# EAGLE design TMotor_Rev0_1 (EAGLE 9.6.2)

## Sheet 1 of 5: Arduino Nano Sense and Teensy
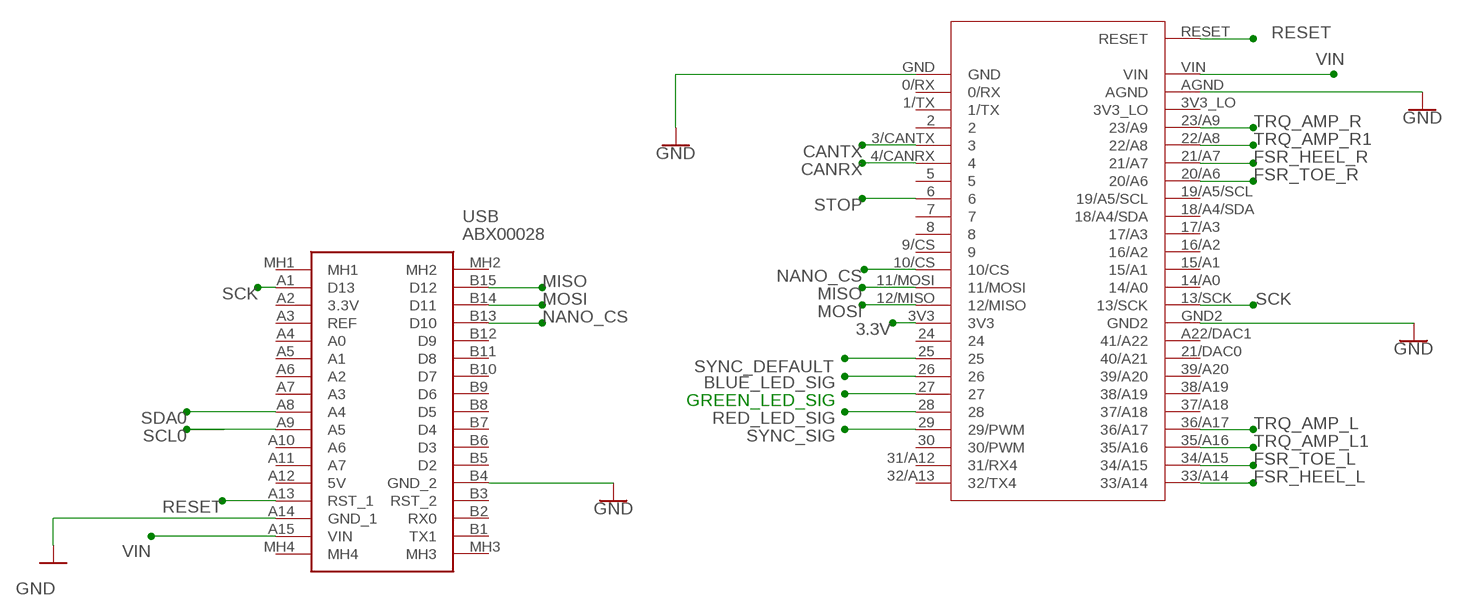
[diagram p0: schematic, sheet 1]

### Parts
U$1  TEENSY_3.5/3.6_EXTERNAL_W/RESET  [TEENSY_3.5/3.6_EXTERNAL_W/RESET]
USB  ABX00028  [ABX00028]

### Nets
3.3V: U$1.3V3 ; also sheet 2,3,5
BLUE_LED_SIG: U$1.26 ; also sheet 4
CANRX: U$1.4/CANRX ; also sheet 2
CANTX: U$1.3/CANTX ; also sheet 2
FSR_HEEL_L: U$1.33/A14 ; also sheet 3
FSR_HEEL_R: U$1.21/A7 ; also sheet 3
FSR_TOE_L: U$1.34/A15 ; also sheet 3
FSR_TOE_R: U$1.20/A6 ; also sheet 3
GND: U$1.AGND U$1.GND U$1.GND2 USB.A14(GND_1) USB.B4(GND_2) ; also sheet 2,3,4,5
GREEN_LED_SIG: U$1.27 ; also sheet 4
MISO: U$1.11/MOSI USB.B15(D12)
MOSI: U$1.12/MISO USB.B14(D11)
NANO_CS: U$1.10/CS USB.B13(D10)
RED_LED_SIG: U$1.28 ; also sheet 4
RESET: U$1.RESET USB.A13(RST_1) ; also sheet 2
SCK: U$1.13/SCK USB.A1(D13)
SCL0: USB.A9(A5) ; also sheet 2
SDA0: USB.A8(A4) ; also sheet 2
STOP: U$1.6 ; also sheet 2
SYNC_DEFAULT: U$1.25 ; also sheet 2
SYNC_SIG: U$1.29(29/PWM) ; also sheet 4
TRQ_AMP_L: U$1.36/A17 ; also sheet 5
TRQ_AMP_L1: U$1.35/A16 ; also sheet 5
TRQ_AMP_R: U$1.23/A9 ; also sheet 5
TRQ_AMP_R1: U$1.22/A8 ; also sheet 5
VIN: U$1.VIN USB.A15(VIN) ; also sheet 2,4
Unconnected: U$1.0/RX U$1.1/TX U$1.2 U$1.3V3_LO U$1.5 U$1.7 U$1.8 U$1.9/CS U$1.14/A0 U$1.15/A1 U$1.16/A2 U$1.17/A3 U$1.18/A4/SDA U$1.19/A5/SCL U$1.21/DAC0(40/A21) U$1.24 U$1.30(30/PWM) U$1.31/A12(31/RX4) U$1.32/A13(32/TX4) U$1.37/A18 U$1.38/A19 U$1.39/A20 U$1.A22/DAC1(41/A22) USB.A2(3.3V) USB.A3(REF) USB.A4(A0) USB.A5(A1) USB.A6(A2) USB.A7(A3) USB.A10(A6) USB.A11(A7) USB.A12(5V) USB.B1(TX1) USB.B2(RX0) USB.B3(RST_2) USB.B5(D2) USB.B6(D3) USB.B7(D4) USB.B8(D5) USB.B9(D6) USB.B10(D7) USB.B11(D8) USB.B12(D9) USB.MH1 USB.MH2 USB.MH3 USB.MH4

## Sheet 2 of 5: Motor Drivers & Power
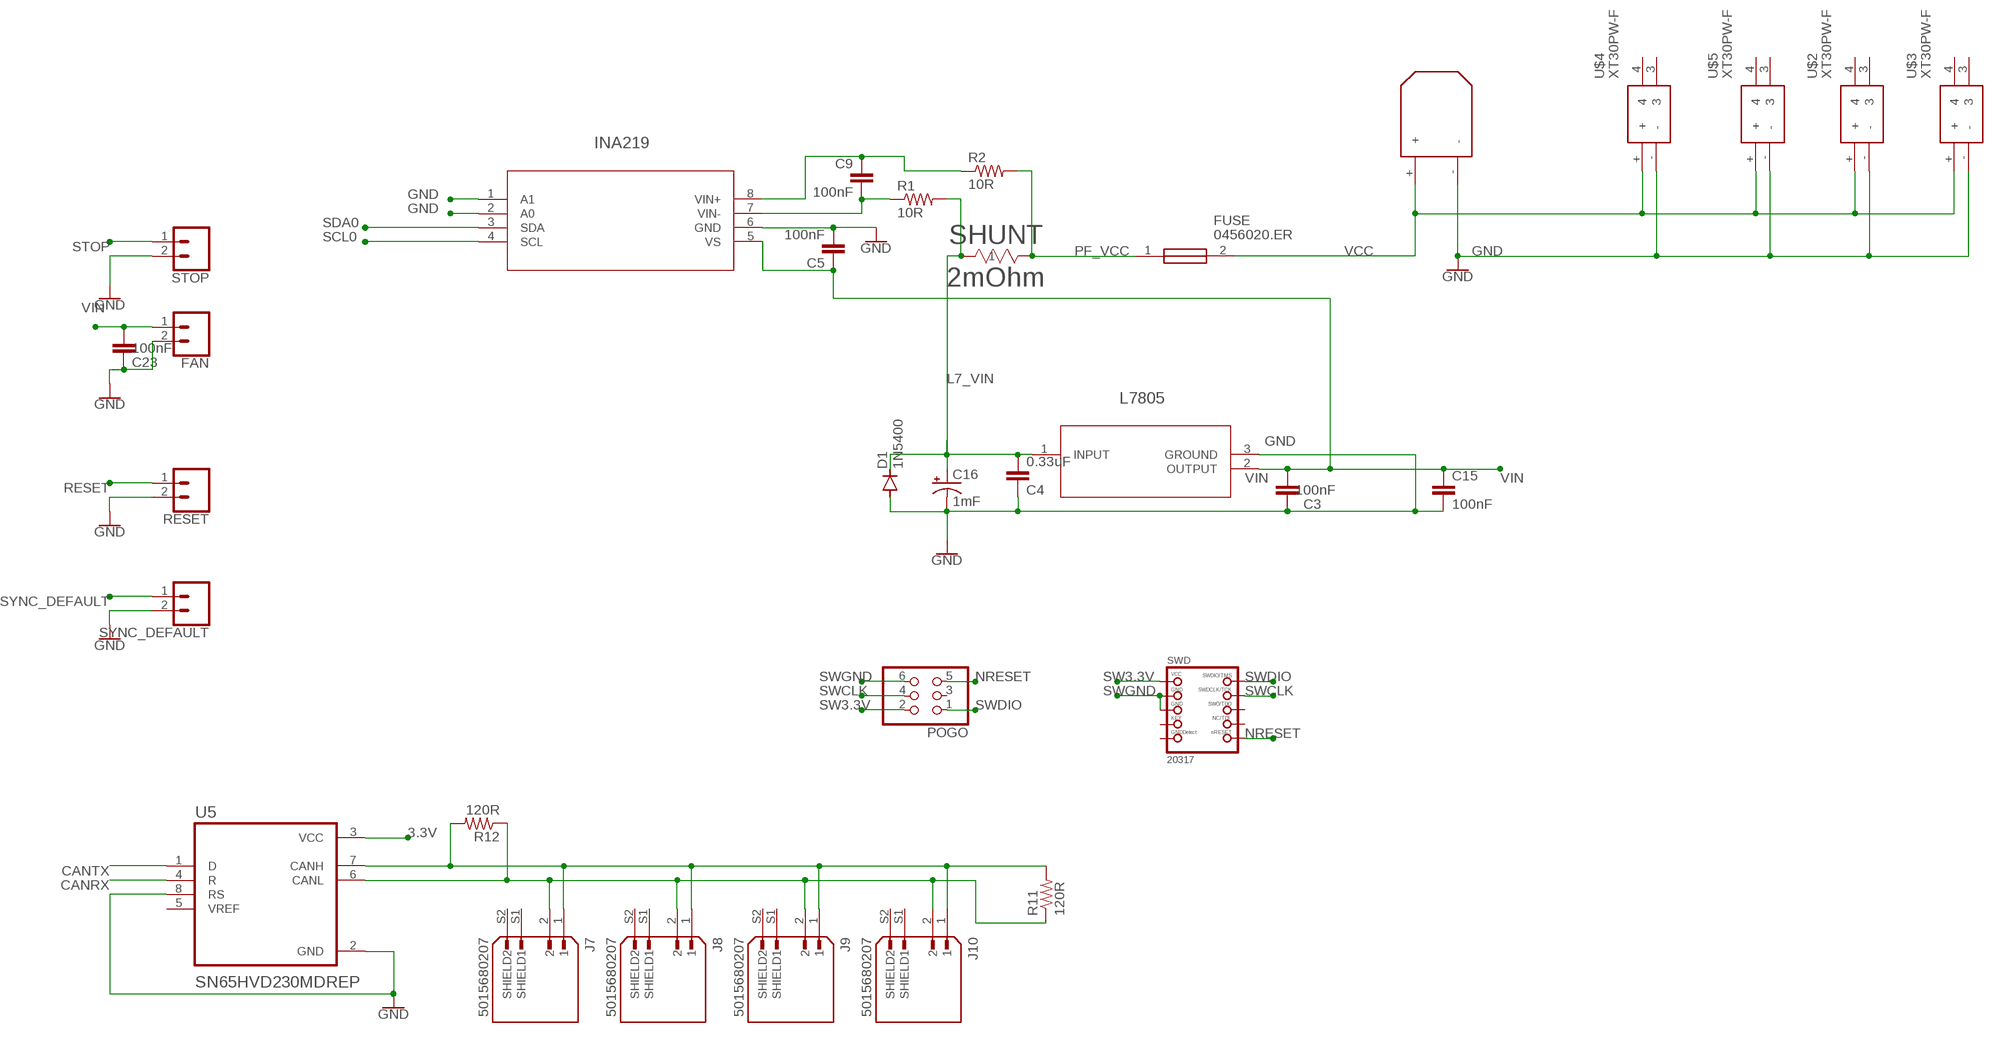
[diagram p1: schematic, sheet 2]

### Parts
C3  100nF  C-EU050-024X044  [C050-024X044]
C4  0.33uF  C-EU050-024X044  [C050-024X044]
C5  100nF  C-EU050-024X044  [C050-024X044]
C9  100nF  C-EU050-024X044  [C050-024X044]
C15  100nF  C-EU050-024X044  [C050-024X044]
C16  1mF  CPOL-USE5-10.5  [E5-10,5]
C23  100nF  C-EU050-024X044  [C050-024X044]
D1  1N5400  [DO201-15]
FAN  CONN_02  [1X02]
FUSE  0456020.ER  [FUSC10131X312N]
INA219  INA219AIDR  [D8_TEX]
J7  5015680207  [MOLEX_5015680207]
J8  5015680207  [MOLEX_5015680207]
J9  5015680207  [MOLEX_5015680207]
J10  5015680207  [MOLEX_5015680207]
L7805  L7805CDT-TR  [DPAK_STM]
POGO  PINHD-2X3  [2X03]
R1  10R  R-US_0207/10  [0207/10]
R2  10R  R-US_0207/10  [0207/10]
R11  120R  R-US_0207/10  [0207/10]
R12  120R  R-US_0207/10  [0207/10]
RESET  CONN_02  [1X02]
SHUNT  2mOhm  CSNL2512FT2L00  [STA_CSNL2512(2)_STP]
STOP  CONN_02  [1X02]
SWD  20317  JTAG-CORTEXBOXPOSTS  [2X05_1.27MM_BOX_POSTS]
SYNC_DEFAULT  CONN_02  [1X02]
U5  SN65HVD230MDREP  [SOIC127P599X175-8N]
U$2  XT30PW-F  [XT30PWF]
U$3  XT30PW-F  [XT30PWF]
U$4  XT30PW-F  [XT30PWF]
U$5  XT30PW-F  [XT30PWF]
U$9  XT30  [XT30_HORIZONTAL]

### Nets
3.3V: U5.3(VCC) ; also sheet 1,3,5
CANRX: U5.4(R) ; also sheet 1
CANTX: U5.1(D) ; also sheet 1
GND: C3.1 C4.1 C5.2 C15.2 C16.- C23.1 D1.A FAN.2 INA219.1(A1) INA219.2(A0) INA219.6(GND) L7805.3(GROUND) RESET.2 STOP.2 SYNC_DEFAULT.2 U5.2(GND) U5.8(RS) U$2.- U$3.- U$4.- U$5.- U$9.- ; also sheet 1,3,4,5
L7_VIN: C4.2 C16.+ D1.C L7805.1(INPUT) R1.2 SHUNT.1
N$23: C9.1 INA219.8(VIN+) R2.1
N$26: C9.2 INA219.7(VIN-) R1.1
N$44: J7.1 J8.1 J9.1 J10.1 R11.2 R12.2 U5.7(CANH)
N$45: J7.2 J8.2 J9.2 J10.2 R11.1 R12.1 U5.6(CANL)
NRESET: POGO.5 SWD.10(NRESET)
PF_VCC: FUSE.1 R2.2 SHUNT.2
RESET: RESET.1 ; also sheet 1
SCL0: INA219.4(SCL) ; also sheet 1
SDA0: INA219.3(SDA) ; also sheet 1
STOP: STOP.1 ; also sheet 1
SW3.3V: POGO.2 SWD.1(VCC)
SWCLK: POGO.4 SWD.4(SWDCLK)
SWDIO: POGO.1 SWD.2(SWDIO)
SWGND: POGO.6 SWD.3(GND) SWD.5(GND)
SYNC_DEFAULT: SYNC_DEFAULT.1 ; also sheet 1
VCC: FUSE.2 U$2.+ U$3.+ U$4.+ U$5.+ U$9.+
VIN: C3.2 C5.1 C15.1 C23.2 FAN.1 INA219.5(VS) L7805.2(OUTPUT) ; also sheet 1,4
Unconnected: J7.S1(SHIELD1) J7.S2(SHIELD2) J8.S1(SHIELD1) J8.S2(SHIELD2) J9.S1(SHIELD1) J9.S2(SHIELD2) J10.S1(SHIELD1) J10.S2(SHIELD2) POGO.3 SWD.6(SWO) SWD.7(KEY) SWD.8(TDI) SWD.9(GNDDETECT) U5.5(VREF) U$2.3 U$2.4 U$3.3 U$3.4 U$4.3 U$4.4 U$5.3 U$5.4

## Sheet 3 of 5: FSRs filters
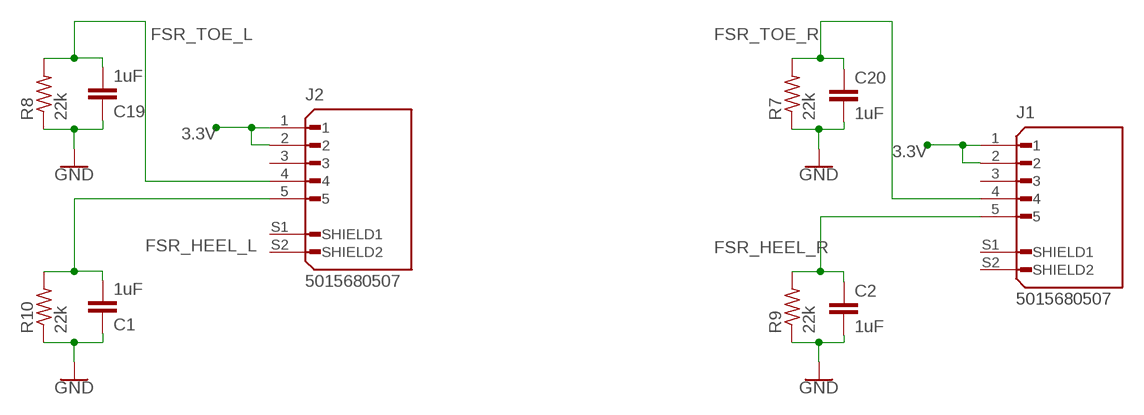
[diagram p2: schematic, sheet 3]

### Parts
C1  1uF  C-EU050-024X044  [C050-024X044]
C2  1uF  C-EU050-024X044  [C050-024X044]
C19  1uF  C-EU050-024X044  [C050-024X044]
C20  1uF  C-EU050-024X044  [C050-024X044]
J1  5015680507  [MOLEX_5015680507]
J2  5015680507  [MOLEX_5015680507]
R7  22k  R-US_0207/10  [0207/10]
R8  22k  R-US_0207/10  [0207/10]
R9  22k  R-US_0207/10  [0207/10]
R10  22k  R-US_0207/10  [0207/10]

### Nets
3.3V: J1.1 J1.2 J2.1 J2.2 ; also sheet 1,2,5
FSR_HEEL_L: C1.2 J2.5 R10.2 ; also sheet 1
FSR_HEEL_R: C2.1 J1.5 R9.2 ; also sheet 1
FSR_TOE_L: C19.2 J2.4 R8.2 ; also sheet 1
FSR_TOE_R: C20.1 J1.4 R7.2 ; also sheet 1
GND: C1.1 C2.2 C19.1 C20.2 R7.1 R8.1 R9.1 R10.1 ; also sheet 1,2,4,5
Unconnected: J1.3 J1.S1(SHIELD1) J1.S2(SHIELD2) J2.3 J2.S1(SHIELD1) J2.S2(SHIELD2)

## Sheet 4 of 5: LED
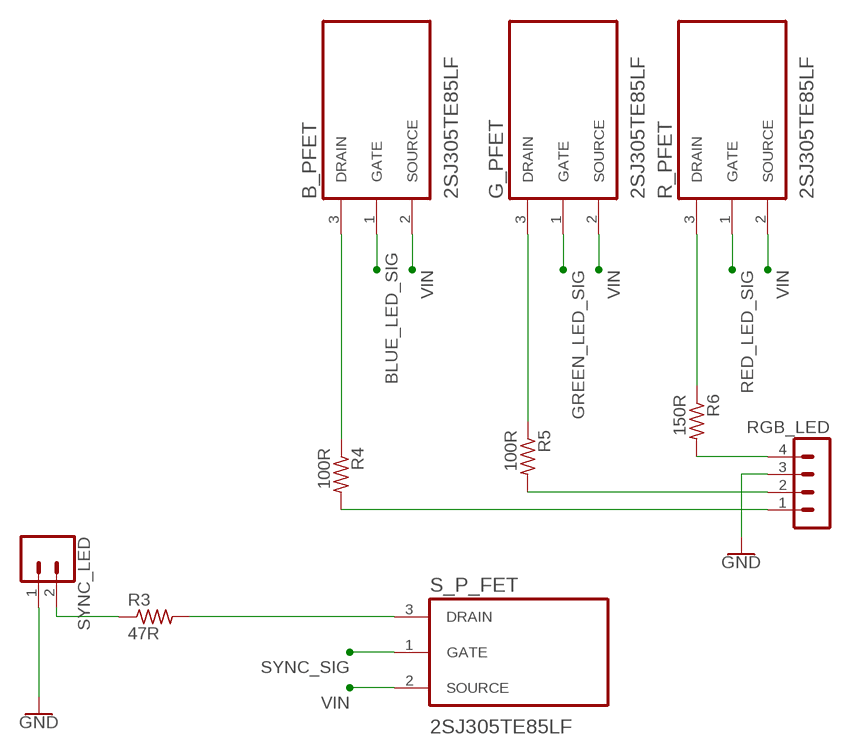
[diagram p3: schematic, sheet 4]

### Parts
B_PFET  2SJ305TE85LF  [TRANS_SSM3J325F,LF]
G_PFET  2SJ305TE85LF  [TRANS_SSM3J325F,LF]
R3  47R  R-US_0207/10  [0207/10]
R4  100R  R-US_0207/10  [0207/10]
R5  100R  R-US_0207/10  [0207/10]
R6  150R  R-US_0207/10  [0207/10]
R_PFET  2SJ305TE85LF  [TRANS_SSM3J325F,LF]
RGB_LED  MA04-1  [MA04-1]
S_P_FET  2SJ305TE85LF  [TRANS_SSM3J325F,LF]
SYNC_LED  CONN_02  [1X02]

### Nets
BLUE_LED_SIG: B_PFET.1(GATE) ; also sheet 1
GND: RGB_LED.3 SYNC_LED.1 ; also sheet 1,2,3,5
GREEN_LED_SIG: G_PFET.1(GATE) ; also sheet 1
N$1: R4.2 RGB_LED.1
N$2: B_PFET.3(DRAIN) R4.1
N$17: R3.2 S_P_FET.3(DRAIN)
N$18: R3.1 SYNC_LED.2
N$24: R6.2 RGB_LED.4
N$25: R5.2 RGB_LED.2
N$30: G_PFET.3(DRAIN) R5.1
N$31: R6.1 R_PFET.3(DRAIN)
RED_LED_SIG: R_PFET.1(GATE) ; also sheet 1
SYNC_SIG: S_P_FET.1(GATE) ; also sheet 1
VIN: B_PFET.2(SOURCE) G_PFET.2(SOURCE) R_PFET.2(SOURCE) S_P_FET.2(SOURCE) ; also sheet 1,2

## Sheet 5 of 5: Bluetooth
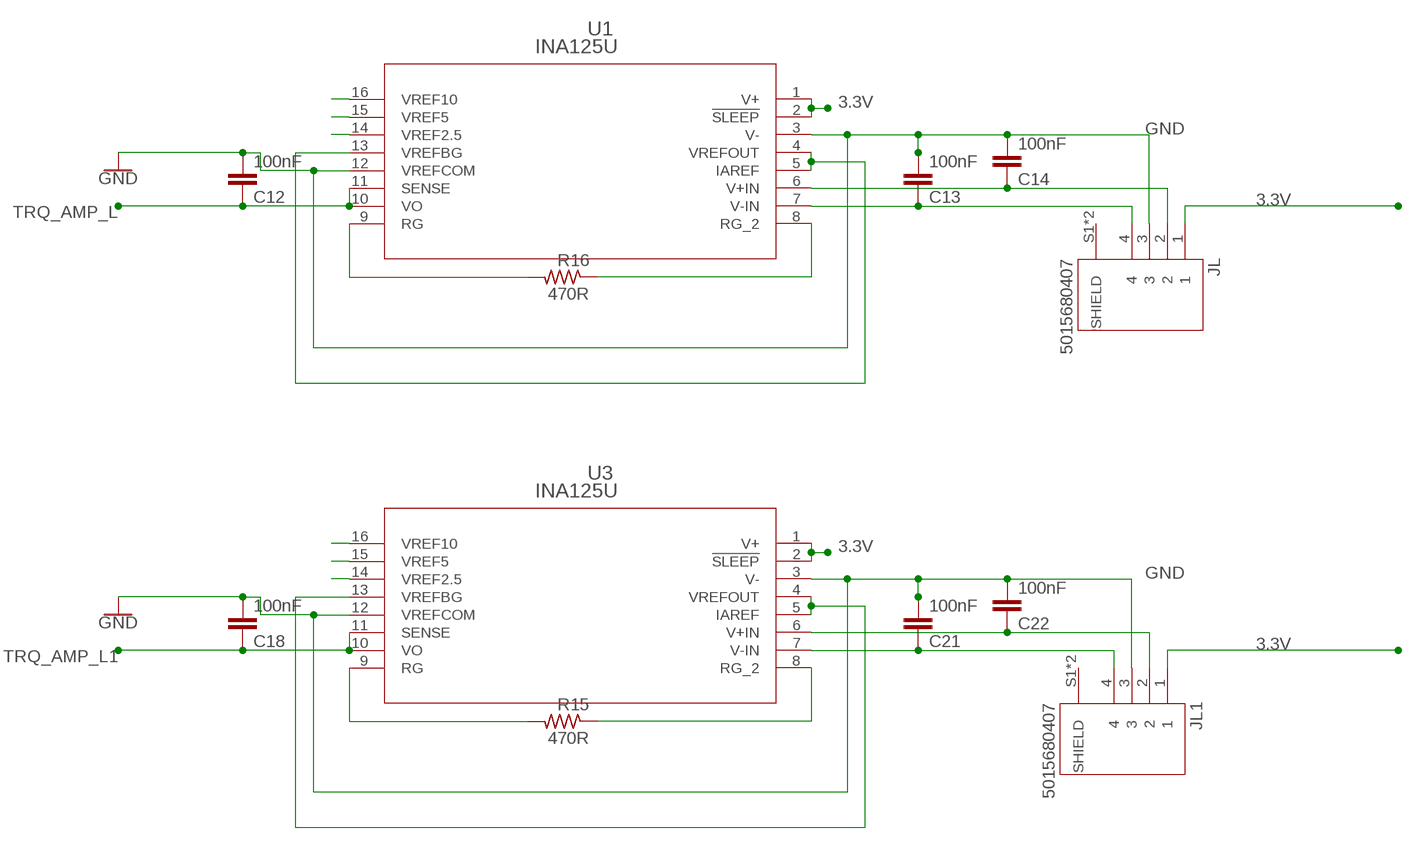
[diagram p4: schematic, sheet 5, part 1 of 2]
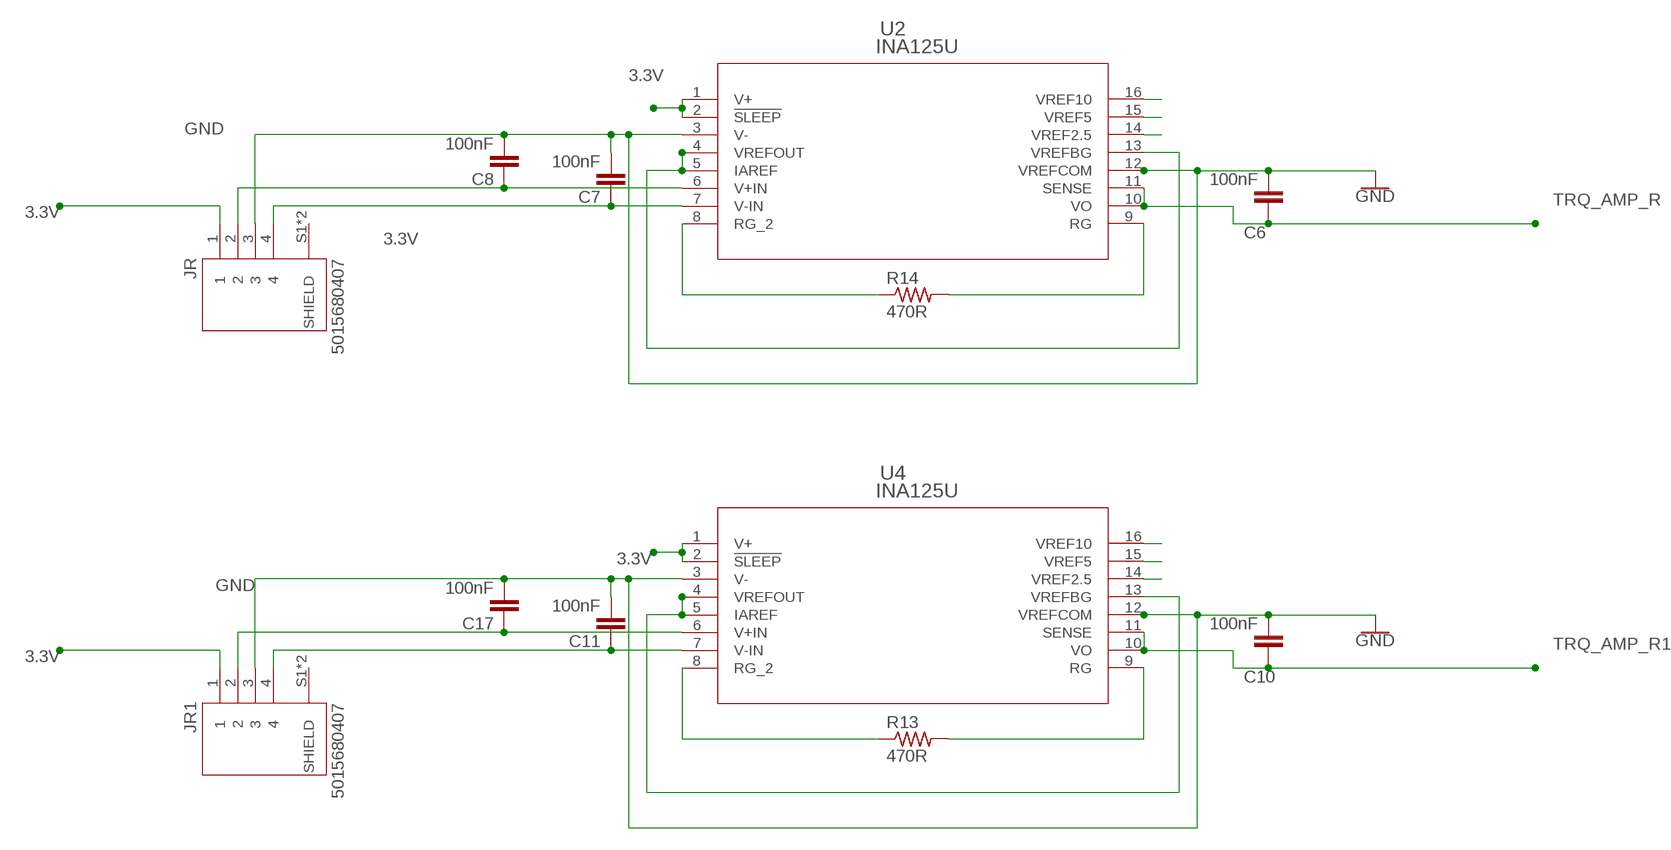
[diagram p5: schematic, sheet 5, part 2 of 2]

### Parts
C6  100nF  C-EU050-024X044  [C050-024X044]
C7  100nF  C-EU050-024X044  [C050-024X044]
C8  100nF  C-EU050-024X044  [C050-024X044]
C10  100nF  C-EU050-024X044  [C050-024X044]
C11  100nF  C-EU050-024X044  [C050-024X044]
C12  100nF  C-EU050-024X044  [C050-024X044]
C13  100nF  C-EU050-024X044  [C050-024X044]
C14  100nF  C-EU050-024X044  [C050-024X044]
C17  100nF  C-EU050-024X044  [C050-024X044]
C18  100nF  C-EU050-024X044  [C050-024X044]
C21  100nF  C-EU050-024X044  [C050-024X044]
C22  100nF  C-EU050-024X044  [C050-024X044]
JL  5015680407  [MOLEX_5015680407]
JL1  5015680407  [MOLEX_5015680407]
JR  5015680407  [MOLEX_5015680407]
JR1  5015680407  [MOLEX_5015680407]
R13  470R  R-US_0207/10  [0207/10]
R14  470R  R-US_0207/10  [0207/10]
R15  470R  R-US_0207/10  [0207/10]
R16  470R  R-US_0207/10  [0207/10]
U1  INA125U  [D16]
U2  INA125U  [D16]
U3  INA125U  [D16]
U4  INA125U  [D16]

### Nets
3.3V: JL1.1 JL.1 JR1.1 JR.1 U1.1(V+) U1.2(!SLEEP) U2.1(V+) U2.2(!SLEEP) U3.1(V+) U3.2(!SLEEP) U4.1(V+) U4.2(!SLEEP) ; also sheet 1,2,3
GND: C6.2 C7.2 C8.2 C10.2 C11.2 C12.2 C13.2 C14.2 C17.2 C18.2 C21.2 C22.2 JL1.3 JL.3 JR1.3 JR.3 U1.3(V-) U1.12(VREFCOM) U2.3(V-) U2.12(VREFCOM) U3.3(V-) U3.12(VREFCOM) U4.3(V-) U4.12(VREFCOM) ; also sheet 1,2,3,4
N$3: U1.4(VREFOUT) U1.5(IAREF) U1.13(VREFBG)
N$4: U4.16(VREF10)
N$5: U2.4(VREFOUT) U2.5(IAREF) U2.13(VREFBG)
N$6: R14.1 U2.8(RG_2)
N$7: R14.2 U2.9(RG)
N$8: C8.1 JR.2 U2.6(V+IN)
N$9: C7.1 JR.4 U2.7(V-IN)
N$10: C14.1 JL.2 U1.6(V+IN)
N$11: C13.1 JL.4 U1.7(V-IN)
N$12: R16.2 U1.9(RG)
N$13: R16.1 U1.8(RG_2)
N$14: U4.15(VREF5)
N$15: U4.4(VREFOUT) U4.5(IAREF) U4.13(VREFBG)
N$16: R13.1 U4.8(RG_2)
N$19: U4.14(VREF2.5)
N$20: U2.16(VREF10)
N$21: U2.15(VREF5)
N$22: U2.14(VREF2.5)
N$27: R13.2 U4.9(RG)
N$28: C17.1 JR1.2 U4.6(V+IN)
N$29: C11.1 JR1.4 U4.7(V-IN)
N$32: U3.4(VREFOUT) U3.5(IAREF) U3.13(VREFBG)
N$33: C22.1 JL1.2 U3.6(V+IN)
N$34: C21.1 JL1.4 U3.7(V-IN)
N$35: R15.2 U3.9(RG)
N$36: R15.1 U3.8(RG_2)
N$37: U1.16(VREF10)
N$38: U1.15(VREF5)
N$39: U1.14(VREF2.5)
N$40: U3.16(VREF10)
N$41: U3.15(VREF5)
N$42: U3.14(VREF2.5)
TRQ_AMP_L: C12.1 U1.10(VO) U1.11(SENSE) ; also sheet 1
TRQ_AMP_L1: C18.1 U3.10(VO) U3.11(SENSE) ; also sheet 1
TRQ_AMP_R: C6.1 U2.10(VO) U2.11(SENSE) ; also sheet 1
TRQ_AMP_R1: C10.1 U4.10(VO) U4.11(SENSE) ; also sheet 1
Unconnected: JL1.S1(SHIELD) JL1.S2(SHIELD) JL.S1(SHIELD) JL.S2(SHIELD) JR1.S1(SHIELD) JR1.S2(SHIELD) JR.S1(SHIELD) JR.S2(SHIELD)

## Library data of the parts
B_PFET G_PFET R_PFET S_P_FET = 2SJ305TE85LF:2SJ305TE85LF: None Check prices <https://pricing.snapeda.com/parts/2SJ305TE85LF/Toshiba/view-part?ref=eda>; AVAILABILITY: In Stock; DESCRIPTION: P-Channel 30V 200mA (Ta) 200mW (Ta) Surface Mount SC-59; MF: Toshiba; MP: 2SJ305TE85LF; PACKAGE: SC-59 Toshiba; PRICE: None; PURCHASE-URL: https://pricing.snapeda.com/search/part/2SJ305TE85LF/?ref=eda
C1-C15 C17-C23 = rcl:C-EU: CAPACITOR, European symbol; SPICEPREFIX: C
C16 = rcl:CPOL-US: POLARIZED CAPACITOR, American symbol; SPICEPREFIX: C
D1 = diode:1N5400: DIODE standard rectifier, 3 A, 50 V (Motorola)
FAN RESET STOP SYNC_DEFAULT SYNC_LED = SparkFun-Connectors:CONN_02: Multi connection point. Often used as Generic Header-pin footprint for 0.1 inch spaced/style header connections On any of the 0.1 inch spaced packages, you can populate with these: Break Away Headers - Straight <https://www.sparkfun.com/products/116> (PRT-00116) Break Away Male Headers - Right Angle <https://www.sparkfun.com/products/553> (PRT-00553) Female Headers <https://www.sparkfun.com/products/115> (PRT-00115) Break Away Headers - Machine Pin <https://www.sparkfun.com/products/117> (PRT-00117) Break Away Female Headers - Swiss Machine Pin <https://www.sparkfun.com/products/743> (PRT-00743) For SCREWTERMINALS and SPRING TERMINALS visit here: Screw Terimnals on SparkFun.com <https://www.sparkfun.com/search/results?term=Screw+Terminals> (5mm/3.5mm/2.54mm spacing) This device is also useful as a general connection point to wire up your design to another part of your project. Our various solder wires solder well into these plated through hole pads. Hook-Up Wire - Assortment (Stranded, 22 AWG) <https://www.sparkfun.com/products/11375> (PRT-11375) Hook-Up Wire - Assortment (Solid Core, 22 AWG) <https://www.sparkfun.com/products/11367> (PRT-11367) View the entire wire category on our website here <https://www.sparkfun.com/categories/141> Special notes: Molex polarized connector foot print use with: PRT-08233 with associated crimp pins and housings. 2.54_SCREWTERM for use with PRT-10571. 3.5mm Screw Terminal footprints for PRT-08084 5mm Screw Terminal footprints for use with PRT-08432
FUSE = SamacSys_Parts:0456020.ER: Littelfuse 20A FF Non-Resettable Surface Mount Fuse, 125V ac Source: Datasheet <https://componentsearchengine.com/Datasheets/1/0456020.ER.pdf>; DESCRIPTION: Littelfuse 20A FF Non-Resettable Surface Mount Fuse, 125V ac; HEIGHT: 3.12mm; MANUFACTURER_NAME: LITTELFUSE; MANUFACTURER_PART_NUMBER: 0456020.ER; MOUSER_PART_NUMBER: 576-0456020.ER; MOUSER_PRICE-STOCK: https://www.mouser.com/Search/Refine.aspx?Keyword=576-0456020.ER
INA219 = INA219:INA219AIDR; BUILT_BY: EMA_UL_Team; MANUFACTURER_PART_NUMBER: INA219AIDR; SOURCELIBRARY: TI_2015-1-5; VENDOR: Texas Instruments
J1 J2 = SnapEDA-Library:5015680507; MANUFACTURER: Molex; MAXIMUM_PACKAGE_HEIGHT: 3.2 mm; PARTREV: A; STANDARD: Manufacturer Recommendations
J7-J10 = SnapEDA-Library:5015680207; MANUFACTURER: Molex; MAXIMUM_PACKAGE_HEIGHT: 3.2 mm; PARTREV: A; STANDARD: Manufacturer Recommendations
JL JL1 JR JR1 = SnapEDA-Library:5015680407: Conn Shrouded Header HDR 4 POS 1mm Solder RA SMD Pico-Clasp????? Embossed T/R; MANUFACTURER: MOLEX; PARTREV: C; STANDARD: Manufacturer Recommendation
L7805 = 7805Regulator:L7805CDT-TR; BUILT_BY: EMA_UL_Team; MANUFACTURER_PART_NUMBER: L7805CDT-TR; SOURCELIBRARY: StMicro_2011-06-07; VENDOR: STMicroelectronics
POGO = pinhead:PINHD-2X3: PIN HEADER
R1-R6 R11-R16 = rcl:R-US_: RESISTOR, American symbol; SPICEPREFIX: R
R7-R10 = resistor:R-US_: RESISTOR, American symbol
RGB_LED = con-lstb:MA04-1: PIN HEADER; OC_FARNELL: unknown; OC_NEWARK: unknown
SHUNT = ShuntResistor:CSNL2512FT2L00; BUILT_BY: EMA_UL_Team; MANUFACTURER_PART_NUMBER: CSNL2512FT2L00; SOURCELIBRARY: Stackpole_2014-12-31; VENDOR: Stackpole International
SWD = microbuilder:JTAG-CORTEX: Serial Wire (SW-DP) Connector Standard 0.05" 10-pin connector is for use with the Cortex M and Cortex A SWD (serial wire debugger) interface (SW-DP) Connectors 2x05_1.27MM_SMT - Inexpensive surface-mount header with bare pins, compatible with standard 10-pin SWD cables (4UCON: 16846) 2x05_1.27MM_BOX_NOPOSTS - Polarised surface-mount box (4UCON with caps: 19735, without caps: 15117 2x05_1.27MM_BOX_POSTS - Polarised surface-mount box with mounting holes (4UCON: 20317) Pinout: http://infocenter.arm.com/help/topic/com.arm.doc.faqs/attached/13634/cortex_debug_connectors.pdf http://www.keil.com/peripherals/coresight/connectors.asp
U1-U4 = Digikey:INA125U; DATASHEET_URL: http://www.ti.com/lit/gpn/INA125; DESCRIPTION: Instrumentation Amplifier with Precision Voltage Reference; FAMILY_NAME: SINGLE SUPPLY; GENERIC_PART_NUMBER: INA125; INDUSTRY_STD_PKG_TYPE: SOIC; MANUFACTURER: Texas Instruments; MANUFACTURER_PART_NUMBER: INA125U; PACKAGE_DESIGNATOR: D; PIN_COUNT: 16; VENDOR: Texas Instruments
U5 = SnapEDA-Library:SN65HVD230MDREP
U$1 = Teensy356:TEENSY_3.5/3.6_EXTERNAL_W/RESET
U$2-U$5 = XT30PW-M:XT30PW-F
U$9 = Ben_Library:XT30
USB = ABX00028:ABX00028: Development Boards & Kits - AVR Arduino Nano Every Source: Datasheet <https://store.arduino.cc/arduino-nano-every>; ARROW_PART_NUMBER: ABX00028; ARROW_PRICE-STOCK: https://www.arrow.com/en/products/abx00028/arduino-corporation; DESCRIPTION: Development Boards & Kits - AVR Arduino Nano Every; HEIGHT: 10mm; MANUFACTURER_NAME: Arduino; MANUFACTURER_PART_NUMBER: ABX00028; MOUSER_PART_NUMBER: 782-ABX00028; MOUSER_PRICE-STOCK: https://www.mouser.co.uk/ProductDetail/Arduino/ABX00028/?qs=PzGy0jfpSMtit6rnFl8mVg%3D%3D

## Board
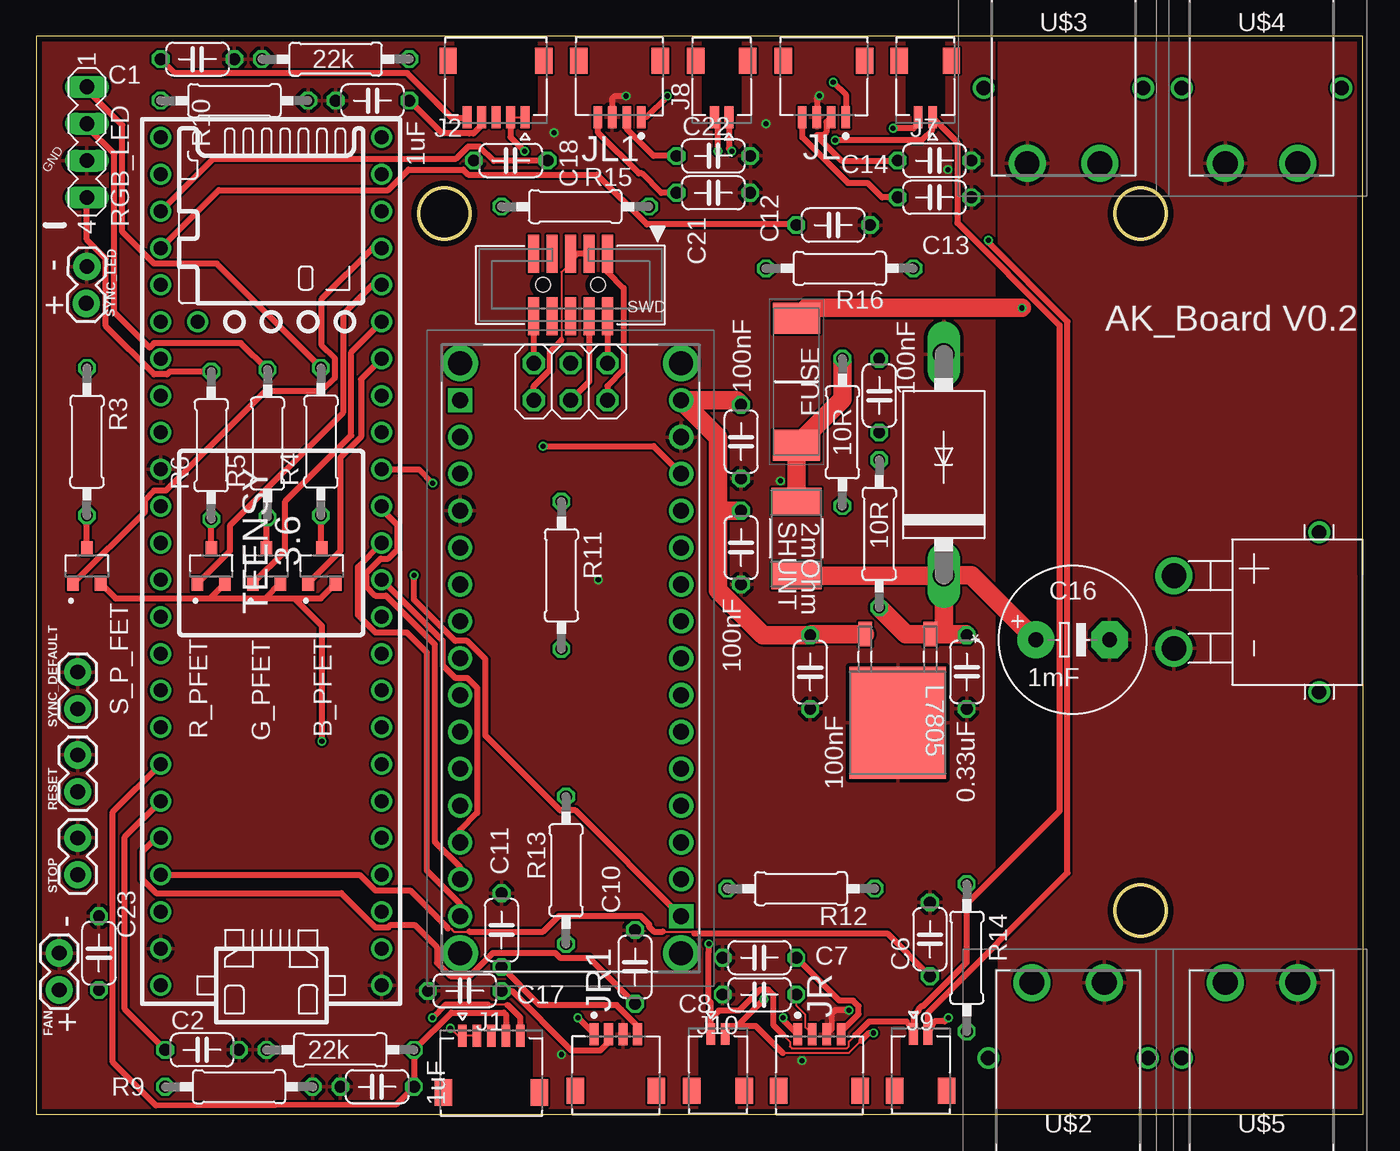
[diagram p6: board, top side]
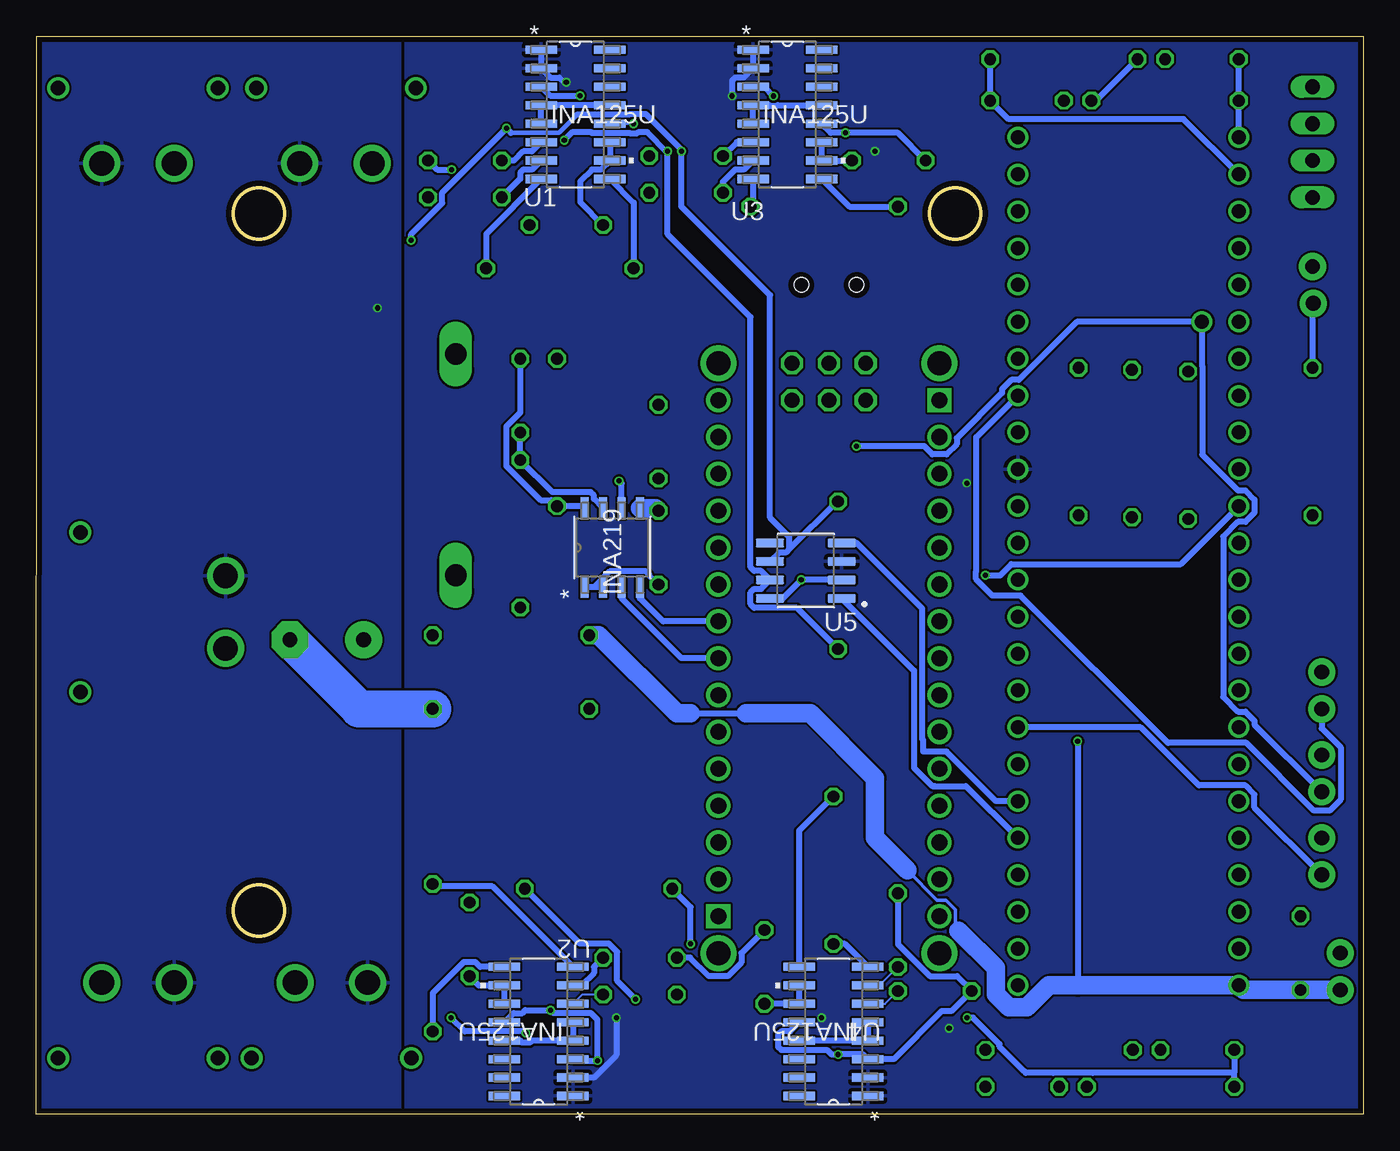
[diagram p7: board, bottom side, seen from below]

Size 91.46 x 74.28 mm. Coordinates in mm from the lower left corner, seen from the top.
Outline: 0,0 91.46,0 91.42,74.28 0,74.28 0,0
Outline: circle at 28.13,62.06 radius 1.75
Outline: circle at 76.13,62.06 radius 1.75
Outline: circle at 76.13,14.06 radius 1.75
Copper layers (1*16): Top 0.035559375mm / dielectric 1.6mm / Bottom 0.035559375mm
Design rules "oshpark-2layer": minimum track width 6mil, minimum drill 10mil, track to track 6mil, track to pad 6mil, pad to pad 6mil, via to via 6mil, smd to smd 6mil, copper to edge 15mil, drill to drill 6mil, minimum pad ring 5mil, minimum via ring 5mil, stop-mask expansion 2.5mil, vias tented up to drill 0mil, thermal gap 10mil

### Footprints (pad centres in the part's own frame; a part is rotated, then mirrored left to right if it is on the bottom)
TRANS_SSM3J325F,LF = smd 1 x 0.8: 1 -1.2,0.95; 2 -1.2,-0.95; 3 1.2,0
C050-024X044 = drill 0.813 octagon: 1 -2.54,0; 2 2.54,0
E5-10,5 = drill 1.016 pad 2.54: + -2.54,0 | drill 1.016 pad 2.54 octagon: - 2.54,0
DO201-15 = drill 1.499 long: A 7.62,0; C -7.62,0
1X02 = drill 1.016 pad 1.88: 1 0,0; 2 2.54,0
FUSC10131X312N = smd 2.16 x 3.23: 1 -4.375,0; 2 4.375,0
D8_TEX = smd 1.46 x 0.559: 1 -2.724,1.905; 2 -2.724,0.635; 3 -2.724,-0.635; 4 -2.724,-1.905; 5 2.724,-1.905; 6 2.724,-0.635; 7 2.724,0.635; 8 2.724,1.905
MOLEX_5015680507 = smd 0.6 x 1.5: 1 -2,2.55; 2 -1,2.55; 3 0,2.55; 4 1,2.55; 5 2,2.55 | smd 1.2 x 1.8: S1 3.3,-1.35; S2 -3.3,-1.35
MOLEX_5015680207 = smd 0.6 x 1.5: 1 -0.5,2.55; 2 0.5,2.55 | smd 1.2 x 1.8: S1 1.8,-1.35; S2 -1.8,-1.35
MOLEX_5015680407 = smd 0.6 x 1.5: 1 -1.5,0; 2 -0.5,0; 3 0.5,0; 4 1.5,0 | smd 1.2 x 1.8: S1 -2.8,-3.9; S2 2.8,-3.9
DPAK_STM = smd 0.94 x 1.702: 1 -2.25,-6.109; 2 2.25,-6.109 | smd 6.655 x 7.722: 3 0,0
2X03 = drill 1.016 octagon: 1 -2.54,-1.27; 2 -2.54,1.27; 3 0,-1.27; 4 0,1.27; 5 2.54,-1.27; 6 2.54,1.27
0207/10 = drill 0.813 octagon: 1 -5.08,0; 2 5.08,0
MA04-1 = drill 1.016 long: 1 -3.81,0; 2 -1.27,0; 3 1.27,0; 4 3.81,0
STA_CSNL2512(2)_STP = smd 1.88 x 3.429: 1 -2.565,0; 2 2.565,0
2X05_1.27MM_BOX_POSTS = smd 0.76 x 2.6: 1 -2.54,-2.15; 2 -2.54,2.15; 3 -1.27,-2.15; 4 -1.27,2.15; 5 0,-2.15; 6 0,2.15; 7 1.27,-2.15; 8 1.27,2.15; 9 2.54,-2.15; 10 2.54,2.15 | hole 1: -1.905,0; 1.905,0
D16 = smd 2.184 x 0.559: 1 -2.362,4.445; 2 -2.362,3.175; 3 -2.362,1.905; 4 -2.362,0.635; 5 -2.362,-0.635; 6 -2.362,-1.905; 7 -2.362,-3.175; 8 -2.362,-4.445; 9 2.362,-4.445; 10 2.362,-3.175; 11 2.362,-1.905; 12 2.362,-0.635; 13 2.362,0.635; 14 2.362,1.905; 15 2.362,3.175; 16 2.362,4.445
SOIC127P599X175-8N = smd 1.97 x 0.6: 1 -2.47,1.905; 2 -2.47,0.635; 3 -2.47,-0.635; 4 -2.47,-1.905; 5 2.47,-1.905; 6 2.47,-0.635; 7 2.47,0.635; 8 2.47,1.905
TEENSY_3.5/3.6_EXTERNAL_W/RESET = drill 0.965: 0/RX -25.4,-7.62; 1/TX -22.86,-7.62; 2 -20.32,-7.62; 3/CANTX -17.78,-7.62; 3V3 7.62,-7.62; 3V3_LO -22.86,7.62; 4/CANRX -15.24,-7.62; 5 -12.7,-7.62; 6 -10.16,-7.62; 7 -7.62,-7.62; 8 -5.08,-7.62; 9/CS -2.54,-7.62; 10/CS 0,-7.62; 11/MOSI 2.54,-7.62; 12/MISO 5.08,-7.62; 13/SCK 5.08,7.62; 14/A0 2.54,7.62; 15/A1 0,7.62; 16/A2 -2.54,7.62; 17/A3 -5.08,7.62; 18/A4/SDA -7.62,7.62; 19/A5/SCL -10.16,7.62; 20/A6 -12.7,7.62; 21/A7 -15.24,7.62; 21/DAC0 12.7,7.62; 22/A8 -17.78,7.62; 23/A9 -20.32,7.62; 24 10.16,-7.62; 25 12.7,-7.62; 26 15.24,-7.62; 27 17.78,-7.62; 28 20.32,-7.62; 29 22.86,-7.62; 30 25.4,-7.62; 31/A12 27.94,-7.62; 32/A13 30.48,-7.62; 33/A14 30.48,7.62; 34/A15 27.94,7.62; 35/A16 25.4,7.62; 36/A17 22.86,7.62; 37/A18 20.32,7.62; 38/A19 17.78,7.62; 39/A20 15.24,7.62; A22/DAC1 10.16,7.62; AGND -25.4,7.62; GND -27.94,-7.62; GND2 7.62,7.62; RESET 17.78,5.08; VIN -27.94,7.62
XT30PWF = drill 1 pad 1.5: 3 5.5,-0.712; 4 -5.5,-0.712 | drill 1.7 pad 2.55: + 2.5,-5.912; - -2.5,-5.912
XT30_HORIZONTAL = drill 1.7: + -2.5,0; - 2.5,0 | drill 1: P$3 5.5,10; P$4 -5.5,10
ABX00028 = drill 1.11 pad 1.665 square: A1 0,0; B1 35.56,15.24 | drill 1.11 pad 1.665: A2 2.54,0; A3 5.08,0; A4 7.62,0; A5 10.16,0; A6 12.7,0; A7 15.24,0; A8 17.78,0; A9 20.32,0; A10 22.86,0; A11 25.4,0; A12 27.94,0; A13 30.48,0; A14 33.02,0; A15 35.56,0; B2 33.02,15.24; B3 30.48,15.24; B4 27.94,15.24; B5 25.4,15.24; B6 22.86,15.24; B7 20.32,15.24; B8 17.78,15.24; B9 15.24,15.24; B10 12.7,15.24; B11 10.16,15.24; B12 7.62,15.24; B13 5.08,15.24; B14 2.54,15.24; B15 0,15.24 | drill 1.65 pad 2.475: MH1 -2.54,0; MH2 -2.54,15.24; MH3 38.1,15.24; MH4 38.1,0

### Placement (x,y rotation side)
B_PFET  19.69,37.79 90 top
C1  11.11,72.71 180 top
C2  11.43,4.45 0 top
C3  48.58,39.05 90 top
C4  64.14,30.48 90 top
C5  53.34,30.48 270 top
C6  61.59,12.07 90 top
C7  49.85,10.8 180 top
C8  49.85,8.26 180 top
C9  58.1,49.53 270 top
C10  41.27,10.16 90 top
C11  32.07,12.7 90 top
C12  54.93,61.28 0 top
C13  61.91,63.19 0 top
C14  61.91,65.73 0 top
C15  48.58,46.36 270 top
C16  71.44,32.71 0 top
C17  29.53,8.51 180 top
C18  32.7,65.73 180 top
C19  23.18,69.85 0 top
C20  23.5,1.91 180 top
C21  46.67,63.5 0 top
C22  46.67,66.04 0 top
C23  4.32,11.11 270 top
D1  62.55,44.77 90 top
FAN  1.59,8.57 90 top
FUSE  52.39,50.48 90 top
G_PFET  15.88,37.79 90 top
INA219  51.75,39.05 90 bottom
J1  31.37,2.86 0 top
J2  31.69,71.25 180 top
J7  61.28,71.25 180 top
J8  47.24,71.25 180 top
J9  60.96,2.99 0 top
J10  46.99,2.99 0 top
JL  54.29,68.71 180 top
JL1  40.2,68.71 180 top
JR  53.98,5.53 0 top
JR1  39.94,5.53 0 top
L7805  59.37,26.99 180 top
POGO  36.83,50.48 180 top
R1  58.1,40.01 270 top
R2  55.56,46.99 90 top
R3  3.49,46.36 270 top
R4  19.62,46.36 90 top
R5  15.94,46.23 90 top
R6  12.07,46.1 90 top
R7  20.96,4.45 0 top
R8  20.64,72.71 0 top
R9  13.97,1.91 180 top
R10  13.65,69.85 180 top
R11  36.2,37.15 270 top
R12  52.7,15.56 180 top
R13  36.51,16.83 90 top
R14  64.14,10.8 270 top
R15  37.15,62.55 180 top
R16  55.37,58.3 180 top
R_PFET  12.07,37.79 90 top
RESET  2.86,22.23 90 top
RGB_LED  3.49,67 270 top
S_P_FET  3.49,37.79 90 top
SHUNT  52.39,39.69 90 top
STOP  2.86,16.51 90 top
SWD  36.83,57.15 180 top
SYNC_DEFAULT  2.86,27.94 90 top
SYNC_LED  3.49,58.42 268.8 top
U1  54.29,68.9 0 bottom
U2  56.83,5.72 180 bottom
U3  39.69,68.9 0 bottom
U4  36.51,5.72 180 bottom
U5  38.42,37.47 180 bottom
U$1  16.19,36.83 90 top
U$2  71.12,3.18 180 top
U$3  70.8,71.44 0 top
U$4  84.45,71.44 0 top
U$5  84.45,3.18 180 top
U$9  78.42,34.61 270 top
USB  44.45,13.65 90 top

### Tracks (layer width: path | path; a pad name or v marks a point on that pad's centre or on a via)
3.3V  (via drill 0.35)
  Top 0.152: J1.2 J1.1 29.07,5.42 v28.54,5.95 | J2.2 J2.1
  Top 0.406: v54.93,71.12 55.79,70.26 JL.1 | v43.5,70.17 42.04,68.71 JL1.1 | JR.1 51.48,6.52 v51.48,6.67 | U$1.3V3 26.38,44.45 v27.33,43.5 | v33.66,66.36 32.69,67.33 J2.2 | v37.33,6.67 38.44,5.56 JR1.1
  Bottom 0.406: U3.1 U3.2 42.69,71.44 43.29,71.44 43.5,71.23 v43.5,70.17 | U1.1 U1.2 56.02,71.44 55.42,71.44 55.1,71.12 v54.93,71.12 | v51.48,6.67 51.48,4.08 53.02,2.54 U2.2
  pour Bottom: -1.27,75.57 66.04,75.57 66.04,-0.38 -1.27,-0.38
BLUE_LED_SIG
  Top 0.406: U$1.26 22.39,50.65 22.39,46.69 20.96,45.25 20.96,38.8 B_PFET.1
CANRX
  Bottom 0.406: U$1.4/CANRX 25.31,21.59 28.72,25 30.33,25 30.33,25.79 30.4,25.86 30.4,34.85 34.93,39.37 U5.4
CANTX
  Bottom 0.406: U$1.3/CANTX 27.39,22.63 29.53,22.63 29.7,22.63 30.96,23.88 30.96,30.57 U5.1
FSR_HEEL_L
  Top 0.406: J2.5 29.53,68.7 29.47,68.64 28.68,68.64 25.57,71.75 9.54,71.75 9.53,71.76 C1.2
  Bottom 0.152: C1.2 R10.2 U$1.33/A14
  Bottom 0.406: U$1.33/A14 C1.2
FSR_HEEL_R  (via drill 0.35)
  Top 0.152: 31.12,7.58 32.45,7.58 32.48,7.55
  Top 0.406: U$1.21/A7 6.1,19.12 6.1,7.24 C2.1 | v27.3,6.67 28.22,7.58 31.12,7.58 | J1.5 33.37,6.67 32.48,7.55
  Bottom 0.152: 23.26,2.86 23.38,2.98
  Bottom 0.406: R9.2 8.89,2.86 | C2.1 8.89,2.86 | 8.89,2.86 18.64,2.86 18.65,2.87 21.36,2.87 21.37,2.86 23.26,2.86 | 23.38,2.98 25.07,4.67 25.07,4.85 26.89,6.67 v27.3,6.67
FSR_TOE_L
  Top 0.406: J2.4 30.69,68.15 30.13,67.59 29.85,67.59 27.98,67.59 C19.2
  Bottom 0.406: R8.2 C19.2 24.45,68.58 12.38,68.58 U$1.34/A15
FSR_TOE_R
  Top 0.406: U$1.20/A6 5.28,20.84 5.28,3.59 8.25,0.62 24.8,0.67 C20.1 R7.2 28.61,7.02 32.22,7.02 32.37,6.88 J1.4
GND  (via drill 0.35)
  Top 0.406: v53.98,70.19 53.79,70.01 JL.3 | v40.64,70.17 39.88,70.17 39.7,69.99 JL1.3 | JR.3 54.82,5.87 54.82,6.93 55.07,7.19 v56.02,7.19
  Bottom 0.152: U5.2 36.2,36.83 | U1.12 v50.29,68.27
  Bottom 0.406: INA219.2 53.02,36.33 | 53.02,36.33 INA219.1 | C3.1 49.21,37.15 49.21,37.21 49.42,37.42 51.94,37.42 53.02,36.33 | U1.3 56.04,70.19 v53.98,70.19 | U3.3 41.27,70.81 v40.64,70.17 | 36.2,36.83 v38.73,36.83 40.01,35.56 U5.8 | C14.2 63.83,65.1 v62.83,65.1 | U2.3 54.37,3.71 v52.78,3.71 52.78,6.54 53.23,6.99 55.82,6.99 v56.02,7.19 57.76,7.19 57.95,6.99 58.56,6.99 U2.12 | U4.12 39.51,5.72 40.11,5.72 40.32,5.51 40.32,4.66 40.11,4.45 36.97,4.45 36.65,4.13 v36.2,4.13 34.47,4.13 U4.3 32.36,3.81 29.06,7.11 28.39,7.11 C17.2 28,9.52 29.87,9.52 32.07,11.72 C11.2 | R8.1 18.41,69.85 R10.1 | INA219.6 51.12,43.47 v51.3,43.65 | C10.2 42.86,11.12 42.86,10.45 43.79,9.52 45.11,9.52 46.39,10.8 C7.2 | C18.2 32.07,67.63 v35.69,67.63 36.69,67.63 U3.12
  Bottom 2.54: C16.- 69.22,27.94 C4.1
  pour Top: -0.32,74.93 66.04,74.93 66.04,-1.27 -0.32,-1.27
  pour Top: 66.36,75.25 92.08,75.25 92.08,-0.95 66.36,-0.95
GREEN_LED_SIG
  Top 0.406: G_PFET.1 17.14,38.8 17.14,40.87 17.16,40.88 17.16,42.24 21.7,46.79 21.7,52.5 U$1.27
L7_VIN
  Top 1.27: C16.+ 64.45,37.15 D1.C | D1.C 62.52,37.12 SHUNT.1 | 62.55,33.1 L7805.1 59.93,33.1 R1.2 | 62.55,33.1 64.06,33.1 C4.2 | D1.C 62.55,33.1
MISO
  Top 0.406: USB.B15 29.21,14.52 26.9,16.82 26.9,31.84 25.53,33.21 23.37,33.21 22.17,34.4 22.17,37.73 U$1.11/MOSI
MOSI
  Top 0.406: USB.B14 29.21,17.05 27.46,18.8 27.46,32.39 24.1,35.75 23.37,35.75 22.73,36.39 22.73,37.15 22.73,37.28 23.75,38.29 24.26,38.29 24.89,38.93 24.89,40.61 23.81,41.69 U$1.12/MISO
N$1
  Top 0.406: RGB_LED.1 3.49,70.61 5.93,68.17 5.93,60.81 8.12,58.61 12.45,58.61 R4.2
N$2
  Top 0.406: B_PFET.3 19.62,39.05 R4.1
N$3
  Bottom 0.406: U1.13 U1.4 U1.5
N$5
  Bottom 0.152: 54.47,5.4 U2.4 | 59.05,5.08 U2.13
  Bottom 0.406: U2.5 54.47,5.4 | U2.4 57.31,5.08 57.44,4.96 57.98,4.96 58.11,5.08 59.05,5.08
N$6
  Bottom 0.152: 63.98,15.72 R14.1
  Bottom 0.406: U2.8 60.03,15.72 63.98,15.72
N$7
  Bottom 0.406: U2.9 60.87,10.16 61.2,10.49 62,10.49 64.14,8.35 64.14,6.67 R14.2
N$8
  Top 0.152: JR.2 53,6 53,6.88 52.39,7.5 C8.1
  Bottom 0.152: C8.1 53.84,8.26 U2.6
N$9
  Top 0.406: JR.4 55.48,5.71 56.67,6.91 56.67,7.46 56.29,7.84 55.34,7.84 C7.1
  Bottom 0.406: C7.1 53.02,10.16 53.02,9.74 53.87,8.89 U2.7
N$10
  Top 0.406: JL.2 54.45,68.37 54.45,67.69 54.24,67.48 53.82,67.48 53.78,67.44 55.5,65.73 C14.1
  Bottom 0.406: U1.6 57.29,66.36 57.89,66.36 58.53,65.73 C14.1
N$11
  Top 0.406: JL.4 52.79,67.31 55.93,64.18 57.3,64.18 58.29,63.19 C13.1
  Bottom 0.406: U1.7 57.29,65.09 57.89,65.09 58.1,64.88 58.1,64.45 C13.1
N$12
  Bottom 0.406: U1.9 50.29,62.82 R16.2
N$13
  Bottom 0.406: U1.8 60.45,60.66 R16.1
N$15
  Bottom 0.152: 34.15,5.4 U4.4 | 38.73,5.08 U4.13
  Bottom 0.406: U4.5 34.15,5.4 | U4.4 38.73,5.08
N$16
  Bottom 0.406: U4.8 35.74,11.75 R13.1
N$17
  Top 0.406: S_P_FET.3 R3.2
N$18
  Bottom 0.406: R3.1 3.49,55.83 SYNC_LED.2
N$23
  Bottom 0.406: INA219.8 53.79,41.91 R2.1 55.97,42.32 56.7,42.32 59.07,44.69 59.07,47.39 58.1,48.36 C9.1
N$24
  Top 0.406: R6.2 9.21,51.18 9.02,50.99 8.12,50.99 4.8,54.32 4.8,58.96 3.49,60.27 RGB_LED.4
N$25
  Top 0.406: R5.2 14.1,53.15 8.12,53.15 7.81,52.84 5.37,55.27 5.37,66.19 3.49,68.07 RGB_LED.2
N$26
  Bottom 0.406: INA219.7 53.02,42.41 53.02,42.66 53.24,42.88 55.89,42.88 R1.1 C9.2
N$27
  Bottom 0.406: R13.2 38.88,19.55 U4.9
N$28
  Top 0.152: JR1.2 39.43,5.4
  Top 0.406: C17.1 32.78,8.51 36.87,4.42 38.89,4.42 39.43,4.97 39.43,5.4
  Bottom 0.152: U4.6 32.96,7.62 C17.1
N$29
  Top 0.406: JR1.4 41.44,6.09 40.31,7.22 40.31,7.23 40.01,7.53 34.7,7.53 C11.1
  Bottom 0.152: U4.7 33.34,8.89 C11.1
N$30
  Top 0.406: G_PFET.3 15.88,41.09 R5.1
N$31
  Top 0.406: R_PFET.3 R6.1
N$32
  Bottom 0.406: U3.5 U3.4 40.94,69.53 40.91,69.51 40.37,69.51 40.34,69.53 U3.13
N$33
  Top 0.406: JL1.2 40.7,67.9 42.56,66.04 C22.1
  Bottom 0.406: U3.6 43.18,67 C22.1
N$34
  Top 0.406: C21.1 43.07,63.5 41.74,64.83 41.53,64.83 38.73,67.63 38.73,68.67 JL1.4
  Bottom 0.406: U3.7 42.69,65.09 43.29,65.09 44.13,64.25 C21.1
N$35
  Bottom 0.406: U3.9 35.42,62.55 R15.2
N$36
  Bottom 0.406: U3.8 42.05,62.73 R15.1
N$44  (via drill 0.35)
  Top 0.152: J7.1 61.75,68.67 | 61.59,7.94 60.46,6.81 60.46,6.67 | 51.5,5.46 51.95,5.01 51.95,4.68 52.08,4.55 55.87,4.55 56,4.68 56,5.01 56.45,5.46
  Top 0.406: v47.94,66.36 47.74,66.56 J8.1 | v55.07,67.12 61.02,67.12 61.75,67.86 61.75,68.67 | 60.46,6.81 60.8,7.15 60.8,7.26 61.01,7.47 61.12,7.47 61.59,7.94 64.14,10.48 64.14,14.51 70.52,20.9 70.52,54.39 63.49,61.42 63.49,66.99 J7.1 | J10.1 46.49,6.67 | 46.49,6.67 46.49,7.71 46.34,7.86 46.34,11.2 46.36,11.21 v46.36,11.75 | 51.5,5.46 50.82,6.14 50.82,8.21 50.44,8.6 49.89,8.6 48.45,7.16 47.04,7.16 46.56,6.67 46.49,6.67 | 56.45,5.46 57.41,6.42 60.01,6.42 J9.1 60.46,6.67
  Bottom 0.406: 47.94,66.28 47.94,60.64 42.23,54.93 42.23,37.7 41.98,37.45 41.5,37.45 U5.7 41.5,36.22 41.98,36.22 42.23,35.97 42.23,35.16 41.98,34.91 39.03,34.91 R11.2 | 47.94,66.28 v47.94,66.36 | 47.94,66.28 49.36,67.69 49.93,67.69 50.02,67.61 50.56,67.61 50.59,67.63 53.17,67.63 53.23,67.69 54.5,67.69 v55.07,67.12 | v46.36,11.75 46.36,14.29 R12.2
N$45  (via drill 0.35)
  Top 0.152: 51.44,4.24 56.03,4.24 56.85,5.07
  Top 0.406: v46.99,66.36 46.99,68.45 J8.2 | v59.05,67.95 59.06,67.94 60.46,67.94 60.78,68.26 J7.2 | v65.62,60.22 65.62,60.08 71.08,54.62 71.08,16.64 61.46,7.01 J9.2 61.91,6.42 62.62,6.42 v62.87,6.67 | v57.71,5.61 57.4,5.61 56.85,5.07 | J10.2 47.48,5.87 47.71,6.1 48.33,6.1 | 48.33,6.1 v50.17,7.94 | 51.44,4.24 49.58,6.1 48.33,6.1
  Bottom 0.305: 58.74,67.63 55.44,67.63 54.17,68.9
  Bottom 0.406: 39.55,38.97 39.55,39.78 40.89,41.12 40.89,56.45 46.99,62.55 v46.99,66.36 46.99,66.48 49.44,68.92 50.56,68.92 50.59,68.9 54.17,68.9 | 58.74,67.63 v59.05,67.95 63.49,63.52 63.49,62.78 65.62,60.66 v65.62,60.22 | v57.71,5.61 57.85,5.61 57.95,5.72 61.91,5.72 v62.87,6.67 | v50.17,7.94 51.42,9.2 51.42,11.2 51.99,11.76 53.99,11.76 R12.1 | 39.55,38.97 39.8,38.72 40.27,38.72 U5.6 | R11.1 36.29,42.23 39.55,38.97
NANO_CS
  Top 0.406: U$1.10/CS 28.02,32.62 28.02,30.94 28.88,30.08 29.7,30.08 30.4,29.39 30.4,20.78 29.21,19.59 USB.B13
NRESET
  Top 0.406: SWD.10 POGO.5
PF_VCC
  Top 1.27: SHUNT.2 FUSE.1 55.56,49.29 R2.2
RED_LED_SIG
  Top 0.406: U$1.28 23.18,57.15 21.15,55.12 21.15,48.36 13.34,40.55 13.34,38.8 R_PFET.1
RESET  (via drill 0.35)
  Top 0.406: v34.93,46.04 42.55,46.04 USB.A13
  Bottom 0.406: v34.93,46.04 30.26,46.04 29.7,45.49 28.72,45.49 28.02,46.18 28.02,46.59 24.89,49.72 24.89,49.98 24.26,50.61 23.75,50.61 19.75,54.61 U$1.RESET 11.11,51.6 11.1,51.58 11.1,45.45 8.64,42.99 8.12,42.99 7.49,42.36 7.49,41.47 8.12,40.83 8.64,40.83 9.65,39.82 9.65,28.76 8.64,27.75 8.12,27.75 7.49,27.12 7.49,26.86 RESET.1
SCK  (via drill 0.35)
  Top 0.406: USB.A1 37.16,20.95 36.11,20.95 30.96,26.1 30.96,31.37 29.7,32.62 28.88,32.62 26.04,35.47 v26.04,37.15
  Bottom 0.406: v26.04,37.15 25.02,37.15 24.26,37.91 12.57,37.91 U$1.13/SCK
SCL0
  Bottom 0.406: USB.A9 48.26,33.98 49.85,35.56 INA219.4
SDA0
  Bottom 0.406: USB.A8 46.99,31.43 51.12,35.56 INA219.3
STOP
  Bottom 0.406: STOP.1 7.49,21.15 7.49,22.04 8.12,22.67 11.33,22.67 15.33,26.67 U$1.6
SW3.3V
  Top 0.406: SWD.1 39.37,58.05 40.49,56.93 40.49,51.29 39.37,50.17 POGO.2
SWCLK
  Top 0.406: SWD.4 38.1,50.48 POGO.4
SWDIO
  Top 0.406: SWD.2 POGO.1
SWGND
  Top 0.152: 37.47,59.3 36.2,58.03 36.2,53.34
  Top 0.406: SWD.3 37.47,59.3 SWD.5 | POGO.6 34.29,50.17 35.41,51.29 35.41,52.55 36.2,53.34
SYNC_DEFAULT
  Bottom 0.406: SYNC_DEFAULT.1 2.86,26.6 1.56,25.3 1.56,21.69 2.32,20.93 3.39,20.93 8.05,25.59 13.46,25.59 23.62,35.75 25.57,35.75 26.69,36.88 26.69,37.42 26.67,37.45 26.67,46.68 U$1.25
SYNC_SIG
  Top 0.406: S_P_FET.1 7.49,41.54 7.49,42.36 8.12,42.99 8.95,42.99 15.81,49.85 19.69,49.85 20.59,50.75 20.59,52.09 19.69,52.99 19.69,56.2 23.18,59.69 U$1.29
TRQ_AMP_L
  Top 0.406: U$1.36/A17 12.57,63.69 24.26,63.69 25.66,65.09 29.43,65.09 29.76,64.76 38.65,64.76 42.08,61.33 52.34,61.33 C12.1
  Bottom 0.406: U1.11 U1.10 52.56,65.09 53.17,65.09 53.98,64.28 53.98,62.87 C12.1
TRQ_AMP_L1
  Top 0.406: C18.1 33.95,65.73 33.93,65.7 31.55,65.7 30.56,66.69 29.76,66.69 28.92,65.85 12.19,65.85 U$1.35/A16
  Bottom 0.406: U3.11 U3.10 C18.1
TRQ_AMP_R
  Top 0.152: 41.62,13.54 42.34,12.82 | 28.37,12.81 28.55,12.81 28.77,12.59 29.85,12.59 | 45.35,12.47 45.23,12.59 43.18,12.59
  Top 0.406: U$1.23/A9 22.29,16.51 23.37,15.43 25.75,15.43 28.37,12.81 | 43.18,12.59 42.58,12.59 42.34,12.82 42.24,12.92 42.24,13.1 41.67,13.67 36,13.67 34.93,12.59 29.85,12.59 | C6.1 58.66,12.47 45.35,12.47
  Bottom 0.406: C6.1 60.96,8.89 U2.10 U2.11
TRQ_AMP_R1
  Top 0.152: C10.1 41.12,7.78 37.99,10.91 36.16,10.91 36.08,11 31.17,11 29.82,9.65 28.6,9.65 27.74,10.51 27.74,11.39 26.07,13.06 | 7.3,18.1 7.3,16.12 8.18,15.24 8.26,15.24
  Top 0.406: U$1.22/A8 8.26,19.05 7.3,18.1 7.3,16.2 8.26,15.24 21.02,15.24 23.37,12.89 24.26,12.89 24.43,13.06 26.07,13.06 27.62,11.52 27.62,10.45 28.55,9.52 29.87,9.52 31.48,11.13 35.77,11.13 36.11,10.79 38.11,10.79 41.12,7.78
  Bottom 0.406: U4.10 U4.11 C10.1
VCC  (via drill 0.35)
  Top 1.27: FUSE.2 53.09,55.57 v67.94,55.57
  pour Bottom: 66.36,74.93 92.08,74.93 92.08,-0.63 66.36,-0.63
VIN  (via drill 0.35)
  Top 0.406: S_P_FET.2 5.46,35.56 11.99,35.56 | B_PFET.2 19.61,35.56 17.78,35.56 | 11.99,35.56 15.8,35.56 | 15.8,35.56 17.78,35.56 | G_PFET.2 15.8,35.56 | R_PFET.2 11.99,35.56 | v19.69,25.72 19.69,33.66 17.78,35.56
  Top 1.27: 46.99,41.6 46.99,46.68 USB.A15 48.26,49.22 C15.1 | 46.99,41.6 46.99,36.13 50.09,33.02 C5.1 53.42,33.1 L7805.2 | C3.2 46.99,41.6
  Bottom 0.254: 27.9,12.67 28.1,12.87 28.1,14.12 28.75,14.77 29.37,14.77 31.43,16.83
  Bottom 0.406: v19.69,25.72 19.69,8.89 | 46.36,27.62 42.55,27.62
  Bottom 1.27: C5.1 52.7,33.02 47.31,27.62 46.36,27.62 | 27.9,12.67 25.32,10.09 25.32,8.27 24.44,7.38 23.19,7.38 21.68,8.89 19.69,8.89 U$1.VIN 8.26,8.57 FAN.1 C23.2 | 31.43,16.83 33.66,19.05 33.66,23.18 38.1,27.62 42.55,27.62 | C3.2 48.76,41.78 INA219.5

### Text on the board
tPlace: AK_Board V0.2
_tsilk: GND | - | + | - | + | Next version change led supply voltage from Vin to 3v3.